# EAGLE schematic InterfaceBoard (EAGLE 6.5.0)
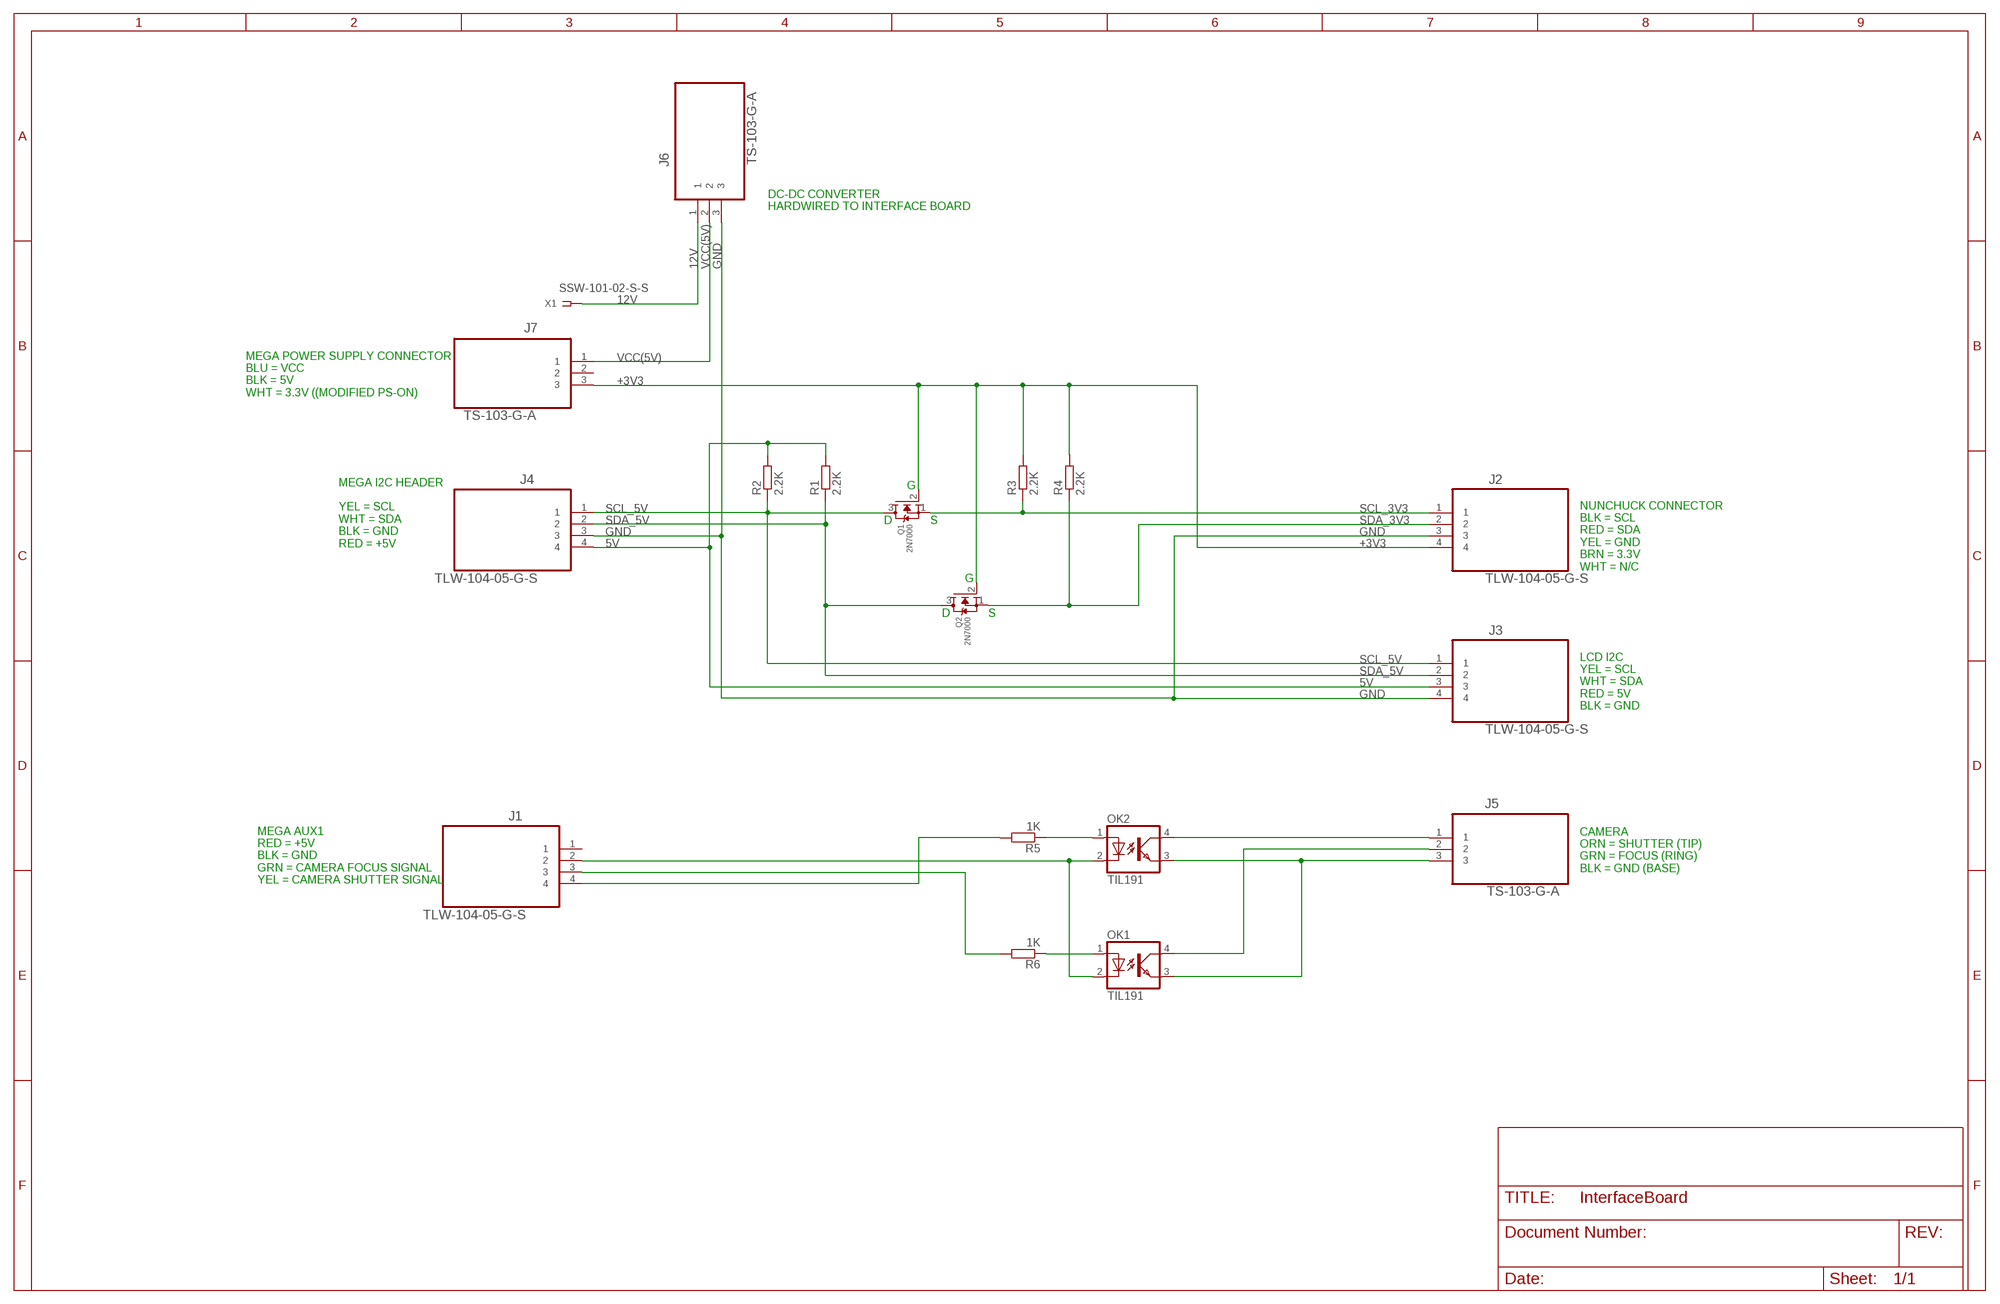
[diagram p0: schematic, sheet 1]

## Parts
J1  TLW-104-05-G-S  [SAMTEC_TLW-104-05-G-S]
J2  TLW-104-05-G-S  [SAMTEC_TLW-104-05-G-S]
J3  TLW-104-05-G-S  [SAMTEC_TLW-104-05-G-S]
J4  TLW-104-05-G-S  [SAMTEC_TLW-104-05-G-S]
J5  TS-103-G-A  [SAMTEC_TS-103-G-A]
J6  TS-103-G-A  [SAMTEC_TS-103-G-A]
J7  TS-103-G-A  [SAMTEC_TS-103-G-A]
OK1  TIL191  [DIL04]
OK2  TIL191  [DIL04]
Q1  2N7000  MOSFET-NREFLOW  [SOT23]
Q2  2N7000  MOSFET-NREFLOW  [SOT23]
R1  2.2K  R-EU_0207/12  [0207/12]
R2  2.2K  R-EU_0207/12  [0207/12]
R3  2.2K  R-EU_0207/12  [0207/12]
R4  2.2K  R-EU_0207/12  [0207/12]
R5  1K  R-EU_0207/12  [0207/12]
R6  1K  R-EU_0207/12  [0207/12]
X1  SSW-101-02-S-S  [SSW-101-02-S-S]

## Nets
5V: J3.3 J4.4 R1.2 R2.2
12V: J6.1 X1.1
+3V3: J2.4 J7.3 Q1.2(G) Q2.2(G) R3.2 R4.2
GND: J2.3 J3.4 J4.3 J6.3
N$1: J5.3 OK1.3(EMIT) OK2.3(EMIT)
N$2: J5.1 OK2.4(COL)
N$3: J5.2 OK1.4(COL)
N$4: J1.2 OK1.2(C) OK2.2(C)
N$5: J1.3 R6.2
N$6: J1.4 R5.2
N$7: OK2.1(A) R5.1
N$8: OK1.1(A) R6.1
SCL_3V3: J2.1 Q1.1(S) R3.1
SCL_5V: J3.1 J4.1 Q1.3(D) R2.1
SDA_3V3: J2.2 Q2.1(S) R4.1
SDA_5V: J3.2 J4.2 Q2.3(D) R1.1
VCC(5V): J6.2 J7.1
Unconnected: J1.1 J7.2

## Notes on the sheet
- DC-DC CONVERTER
  HARDWIRED TO INTERFACE BOARD
- MEGA POWER SUPPLY CONNECTOR
  BLU = VCC
  BLK = 5V
  WHT = 3.3V ((MODIFIED PS-ON)
- G
- D | S
- MEGA I2C HEADER
  
  YEL = SCL
  WHT = SDA
  BLK = GND
  RED = +5V
- NUNCHUCK CONNECTOR
  BLK = SCL
  RED = SDA
  YEL = GND
  BRN = 3.3V
  WHT = N/C
- G
- D | S
- LCD I2C
  YEL = SCL
  WHT = SDA
  RED = 5V
  BLK = GND
- CAMERA
  ORN = SHUTTER (TIP)
  GRN = FOCUS (RING)
  BLK = GND (BASE)
- MEGA AUX1
  RED = +5V
  BLK = GND
  GRN = CAMERA FOCUS SIGNAL
  YEL = CAMERA SHUTTER SIGNAL

## Library data of the parts
J1-J4 = SAMTEC-Txx_By_element14_Batch_1:TLW-104-05-G-S: CONNECTOR HEADER, 4 WAY, 1ROW; MPN: TLW-104-05-G-S; OC_FARNELL: 1668492; OC_NEWARK: 12P0389; PACKAGE: CONN HEADER 4 POS .100"; SUPPLIER: SAMTEC
J5-J7 = SAMTEC-Txx_By_element14_Batch_1:TS-103-G-A: CONN HEADER, 2.54MM, THT VERT, 3 WAY; MPN: TS-103-G-A; OC_FARNELL: 1668576; OC_NEWARK: 12P1115; PACKAGE: HEADER, 2.54MM, THT VERT,3 WAY; SUPPLIER: SAMTEC
OK1 OK2 = optocoupler:TIL191: TEXAS INSTRUMENTS OPTO COUPLER; OC_FARNELL: 1683363; OC_NEWARK: unknown
Q1 Q2 = adafruit:MOSFET-N: N-Channel Mosfet 2N7002E - 60V 260mA SOT23 [Digikey: 2N7002ET1GOSTR-ND] - REEL BSH103 - 30V 850mA SOT23 [Digikey: 568-5013-1-ND]
R1-R6 = resistor:R-EU_: RESISTOR, European symbol
X1 = con-samtec:SSW-101-02-S-S: THROUGH-HOLE .025" SQ POST SOCKET Source: Samtec SSW.pdf; MPN: SSW-101-02-S-S; OC_FARNELL: unknown; OC_NEWARK: 11P9336